# Altium schematic sheet motor_control.SchDoc
size A4
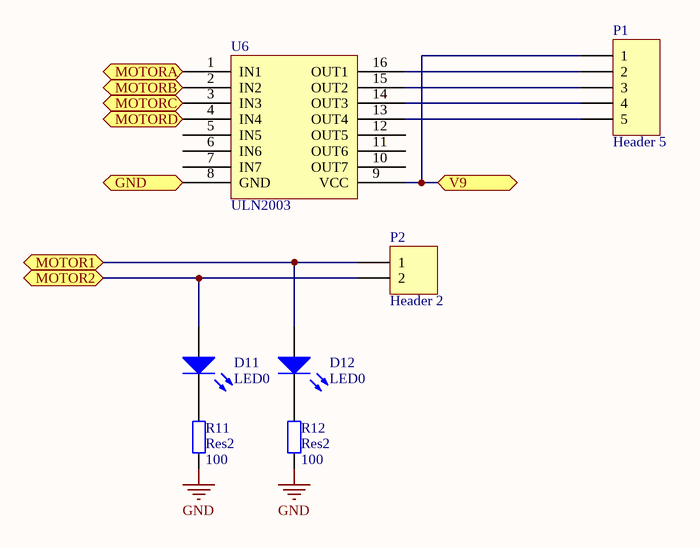
[diagram p0: motor_control.SchDoc]

## Parts
D11  LED0  [1206]
D12  LED0  [1206]
P1  Header 5  [HDR1X5]
P2  Header 2  [HDR1X2]
R11  Res2  value 100  [0603]
R12  Res2  value 100  [0603]
U6  ULN2003  [SOP-16]

## Ports
GND, MOTOR1, MOTOR2, MOTORA, MOTORB, MOTORC, MOTORD, V9

## Nets
GND: R11.1 R12.1
GND: U6.8(GND) ; port GND  [a separate net that carries the same name]
MOTOR1: D12.1(A) P2.1 ; port MOTOR1
MOTOR2: D11.1(A) P2.2 ; port MOTOR2
MOTORA: U6.1(IN1) ; port MOTORA
MOTORB: U6.2(IN2) ; port MOTORB
MOTORC: U6.3(IN3) ; port MOTORC
MOTORD: U6.4(IN4) ; port MOTORD
V9: P1.1 U6.9(VCC) ; port V9
NetD11_2: D11.2(K) R11.2
NetD12_2: D12.2(K) R12.2
NetP1_2: P1.2 U6.16(OUT1)
NetP1_3: P1.3 U6.15(OUT2)
NetP1_4: P1.4 U6.14(OUT3)
NetP1_5: P1.5 U6.13(OUT4)

Not connected (* = marked no-connect by the designer): U6 5(IN5) 6(IN6) 7(IN7) 10(OUT7) 11(OUT6) 12(OUT5)

## Library data of the parts
D11 D12 = LED0: Typical INFRARED GaAs LED; Published: 8-Jun-2000; LatestRevisionDate: 08-Jul-2005; LatestRevisionNote: Mech Layer 1 removed.; PackageReference: LED-0; Publisher: Altium Limited; PackageDescription: LED; 2 Leads
P1 = Header 5: Header, 5-Pin; LatestRevisionDate: 17-Jul-2002; LatestRevisionNote: Re-released for DXP Platform.; Publisher: Altium Limited
P2 = Header 2: Header, 2-Pin; LatestRevisionDate: 17-Jul-2002; LatestRevisionNote: Re-released for DXP Platform.; Publisher: Altium Limited
R11 R12 = Res2: Resistor; Published: 8-Jun-2000; LatestRevisionDate: 17-Jul-2002; LatestRevisionNote: Re-released for DXP Platform.; PackageReference: AXIAL-0.4; Publisher: Altium Limited; PackageDescription: Axial Device, Thru-Hole; 2 Leads; 0.4 in Pin Spacing